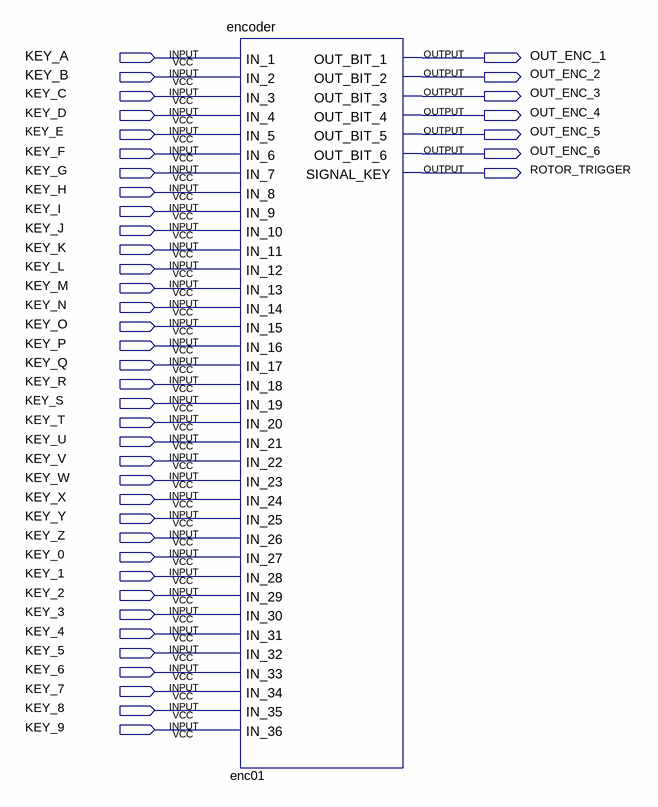
[diagram p0: schematic sheet]
// Quartus schematic keyboard-controller.bdf as structural Verilog: 1 symbols, 43 pins
module \keyboard-controller  (
  input  KEY_A,
  input  KEY_B,
  input  KEY_C,
  input  KEY_D,
  input  KEY_E,
  input  KEY_F,
  input  KEY_G,
  input  KEY_H,
  input  KEY_I,
  input  KEY_J,
  input  KEY_K,
  input  KEY_L,
  input  KEY_M,
  input  KEY_N,
  input  KEY_O,
  input  KEY_P,
  input  KEY_Q,
  input  KEY_R,
  input  KEY_S,
  input  KEY_T,
  input  KEY_U,
  input  KEY_V,
  input  KEY_W,
  input  KEY_X,
  input  KEY_Y,
  input  KEY_Z,
  input  KEY_0,
  input  KEY_1,
  input  KEY_2,
  input  KEY_3,
  input  KEY_4,
  input  KEY_5,
  input  KEY_6,
  input  KEY_7,
  input  KEY_8,
  input  KEY_9,
  output OUT_ENC_1,
  output OUT_ENC_2,
  output OUT_ENC_3,
  output OUT_ENC_4,
  output OUT_ENC_5,
  output OUT_ENC_6,
  output ROTOR_TRIGGER
);

  encoder enc01 (
    .IN_1(KEY_A), .IN_2(KEY_B), .IN_3(KEY_C), .IN_4(KEY_D), .IN_5(KEY_E), .IN_6(KEY_F), .IN_7(KEY_G),
    .IN_8(KEY_H), .IN_9(KEY_I), .IN_10(KEY_J), .IN_11(KEY_K), .IN_12(KEY_L), .IN_13(KEY_M), .IN_14(KEY_N),
    .IN_15(KEY_O), .IN_16(KEY_P), .IN_17(KEY_Q), .IN_18(KEY_R), .IN_19(KEY_S), .IN_20(KEY_T), .IN_21(KEY_U),
    .IN_22(KEY_V), .IN_23(KEY_W), .IN_24(KEY_X), .IN_25(KEY_Y), .IN_26(KEY_Z), .IN_27(KEY_0), .IN_28(KEY_1),
    .IN_29(KEY_2), .IN_30(KEY_3), .IN_31(KEY_4), .IN_32(KEY_5), .IN_33(KEY_6), .IN_34(KEY_7), .IN_35(KEY_8),
    .IN_36(KEY_9), .OUT_BIT_1(OUT_ENC_1), .OUT_BIT_2(OUT_ENC_2), .OUT_BIT_3(OUT_ENC_3),
    .OUT_BIT_4(OUT_ENC_4), .OUT_BIT_5(OUT_ENC_5), .OUT_BIT_6(OUT_ENC_6), .SIGNAL_KEY(ROTOR_TRIGGER));
endmodule
